# EAGLE schematic facedancer21 (EAGLE 6.3)
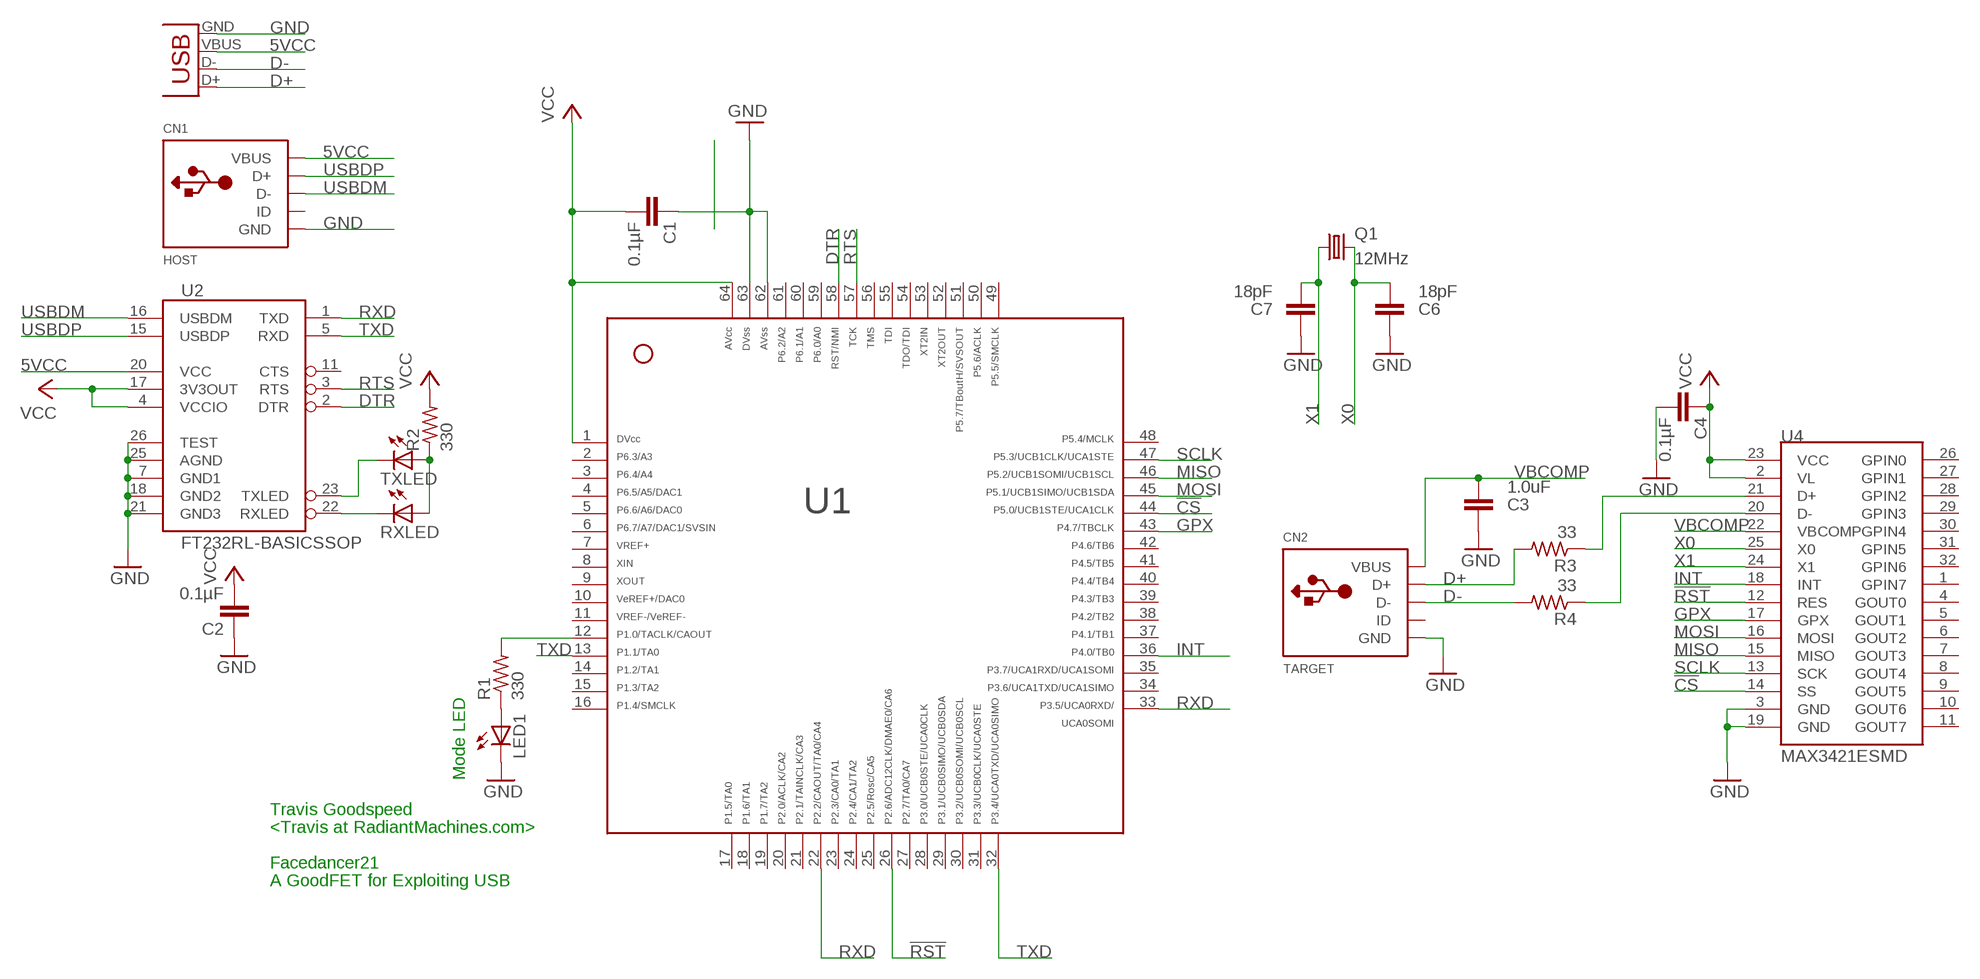
[diagram p0: schematic, sheet 1]

## Parts
C1  0.1µF  C-EUC0603  [C0603]
C2  0.1µF  C-EUC0603  [C0603]
C3  1.0uF  C-EUC0603  [C0603]
C4  0.1µF  C-EUC0603  [C0603]
C6  18pF  C-EUC0603  [C0603]
C7  18pF  C-EUC0603  [C0603]
CN1  HOST  USBMINIB  [USB-MINIB]
CN2  TARGET  USBMINIB  [USB-MINIB]
CN3  USB-A-S  [USB-A-S]
LED1  LEDCHIP-LED0603  [CHIP-LED0603]
Q1  12MHz  CRYSTALHC49UP  [HC49UP]
R1  330  R-US_R0603  [R0603]
R2  330  R-US_R0603  [R0603]
R3  33  R-US_R0603  [R0603]
R4  33  R-US_R0603  [R0603]
RXLED  LEDCHIP-LED0603  [CHIP-LED0603]
TXLED  LEDCHIP-LED0603  [CHIP-LED0603]
U1  F261X---PM64  [PM/PAG64]
U2  FT232RL-BASICSSOP  [SSOP28DB]
U4  MAX3421ESMD  [TQFP32-5MM]

## Nets
5VCC: CN1.VBUS CN3.VBUS U2.20(VCC)
!CS: U1.44 U4.14(SS)
!RST: U1.26 U4.12(RES)
D+: CN2.D+ CN3.D+ R3.2
D-: CN2.D- CN3.D- R4.2
DMINUS: R4.1 U4.20(D-)
DPLUS: R3.1 U4.21(D+)
DTR: U1.58 U2.2(DTR)
GND: C1.1 C2.1 C3.1 C4.2 C6.1 C7.1 CN1.GND CN2.GND CN3.GND LED1.C U1.62 U1.63 U2.7(GND1) U2.18(GND2) U2.21(GND3) U2.25(AGND) U2.26(TEST) U4.3(GND) U4.19(GND)
GPX: U1.43 U4.17(GPX)
INT: U1.36 U4.18(INT)
MISO: U1.46 U4.15(MISO)
MOSI: U1.45 U4.16(MOSI)
N$1: R1.2 U1.12
N$2: LED1.A R1.1
N$6: RXLED.C U2.22(RXLED)
N$7: TXLED.C U2.23(TXLED)
N$8: R2.1 RXLED.A TXLED.A
RTS: U1.57 U2.3(RTS)
RXD: U1.22 U1.33 U2.1(TXD)
SCLK: U1.47 U4.13(SCK)
TXD: U1.13 U1.32 U2.5(RXD)
USBDM: CN1.D- U2.16(USBDM)
USBDP: CN1.D+ U2.15(USBDP)
VBCOMP: C3.2 CN2.VBUS U4.22(VBCOMP)
VCC: C1.2 C2.2 C4.1 R2.2 U1.1 U1.64 U2.4(VCCIO) U2.17(3V3OUT) U4.2(VL) U4.23(VCC)
X0: C6.2 Q1.2 U4.25(X0)
X1: C7.2 Q1.1 U4.24(X1)
Unconnected: CN1.ID CN2.ID U1.2 U1.3 U1.4 U1.5 U1.6 U1.7 U1.8 U1.9 U1.10 U1.11 U1.14 U1.15 U1.16 U1.17 U1.18 U1.19 U1.20 U1.21 U1.23 U1.24 U1.25 U1.27 U1.28 U1.29 U1.30 U1.31 U1.34 U1.35 U1.37 U1.38 U1.39 U1.40 U1.41 U1.42 U1.48 U1.49 U1.50 U1.51 U1.52 U1.53 U1.54 U1.55 U1.56 U1.59 U1.60 U1.61 U2.11(CTS) U4.1(GPIN7) U4.4(GOUT0) U4.5(GOUT1) U4.6(GOUT2) U4.7(GOUT3) U4.8(GOUT4) U4.9(GOUT5) U4.10(GOUT6) U4.11(GOUT7) U4.26(GPIN0) U4.27(GPIN1) U4.28(GPIN2) U4.29(GPIN3) U4.30(GPIN4) U4.31(GPIN5) U4.32(GPIN6)

## Notes on the sheet
- Mode LED
- Travis Goodspeed
- <Travis at RadiantMachines.com>
- Facedancer21
- A GoodFET for Exploiting USB

## Library data of the parts
C1-C4 C6 C7 = rcl:C-EU: CAPACITOR, European symbol
CN1 CN2 = adafruit:USB: USB Connectors USBMINIB - Surface Mount Female Mini-B USB Connector 4UConnector: 06564 By microbuilder.eu Thru-hole RA Female Mini-B USB Connector 4UConnector: 18732 By ladyada.net
CN3 = SparkFun-Connectors:USB: USB Connectors USB-B-PTH is fully proven SKU : PRT-00139/CONN-08278 USB-miniB is fully proven SKU : PRT-00587 USB-A-PCB is untested. USB-A-H is throughly reviewed, but untested. Spark Fun Electronics SKU : PRT-00437 USB-B-SMT is throughly reviewed, but untested. Needs silkscreen touching up. USB-A-S has not been used/tested USB-MB-H has not been used/tested USB-MICROB has been used. CONN-09505
LED1 RXLED TXLED = led:LED: LED OSRAM: - CHIPLED LG R971, LG N971, LY N971, LG Q971, LY Q971, LO R971, LY R971 LH N974, LH R974 LS Q976, LO Q976, LY Q976 LO Q996 - Hyper CHIPLED LW Q18S LB Q993, LB Q99A, LB R99A - SideLED LS A670, LO A670, LY A670, LG A670, LP A670 LB A673, LV A673, LT A673, LW A673 LH A674 LY A675 LS A676, LA A676, LO A676, LY A676, LW A676 LS A679, LY A679, LG A679 - Hyper Micro SIDELED® LS Y876, LA Y876, LO Y876, LY Y876 LT Y87S - SmartLED LW L88C, LW L88S LB L89C, LB L89S, LG L890 LS L89K, LO L89K, LY L89K LS L896, LA L896, LO L896, LY L896 - TOPLED LS T670, LO T670, LY T670, LG T670, LP T670 LSG T670, LSP T670, LSY T670, LOP T670, LYG T670 LG T671, LOG T671, LSG T671 LB T673, LV T673, LT T673, LW T673 LH T674 LS T676, LA T676, LO T676, LY T676, LB T676, LH T676, LSB T676, LW T676 LB T67C, LV T67C, LT T67C, LS T67K, LO T67K, LY T67K, LW E67C LS E67B, LA E67B, LO E67B, LY E67B, LB E67C, LV E67C, LT E67C LW T67C LS T679, LY T679, LG T679 LS T770, LO T770, LY T770, LG T770, LP T770 LB T773, LV T773, LT T773, LW T773 LH T774 LS E675, LA E675, LY E675, LS T675 LS T776, LA T776, LO T776, LY T776, LB T776 LHGB T686 LT T68C, LB T68C - Hyper Mini TOPLED® LB M676 - Mini TOPLED Santana® LG M470 LS M47K, LO M47K, LY M47K Source: http://www.osram.convergy.de LUXEON: - LUMILED® LXK2-PW12-R00, LXK2-PW12-S00, LXK2-PW14-U00, LXK2-PW14-V00 LXK2-PM12-R00, LXK2-PM12-S00, LXK2-PM14-U00 LXK2-PE12-Q00, LXK2-PE12-R00, LXK2-PE12-S00, LXK2-PE14-T00, LXK2-PE14-U00 LXK2-PB12-K00, LXK2-PB12-L00, LXK2-PB12-M00, LXK2-PB14-N00, LXK2-PB14-P00, LXK2-PB14-Q00 LXK2-PR12-L00, LXK2-PR12-M00, LXK2-PR14-Q00, LXK2-PR14-R00 LXK2-PD12-Q00, LXK2-PD12-R00, LXK2-PD12-S00 LXK2-PH12-R00, LXK2-PH12-S00 LXK2-PL12-P00, LXK2-PL12-Q00, LXK2-PL12-R00 Source: www.luxeon.com KINGBRIGHT: KA-3528ASYC Source: www.kingbright.com
Q1 = crystal:CRYSTAL: CRYSTAL; OC_FARNELL: unknown; OC_NEWARK: unknown
R1-R4 = rcl:R-US_: RESISTOR, American symbol
U1 = TI_MSP430_v13:F261X---PM64: ***MSP430F261x***PM64
U2 = SparkFun:FT232RL-BASIC: USB UART This is the simplified version of the FT232RL unit. Only what you need, nothing you don't. Spark Fun Electronics SKU : COM-00650
U4 = SparkFun-DigitalIC:MAX3421E: USB Peripheral/Host Controller w/ SPI